# Altium schematic sheet Regulador.SchDoc
size A4; SheetNumber: 5; SheetTotal: 6
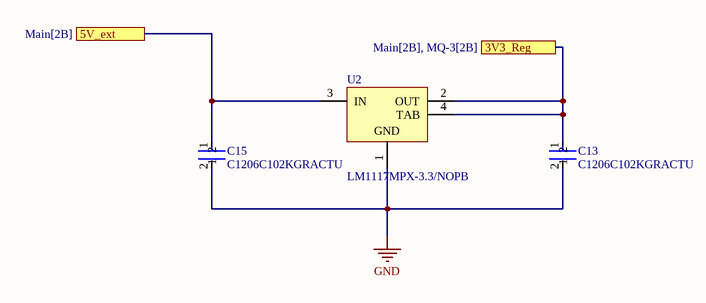
[diagram p0: Regulador.SchDoc]

## Parts
C13  C1206C102KGRACTU  [FP-C1206C-EF-IPC_A]
C15  C1206C102KGRACTU  [FP-C1206C-EF-IPC_A]
U2  LM1117MPX-3.3/NOPB  [DCY0004A_L]

## Ports
3V3_Reg (see Main[2B], MQ-3[2B]), 5V_ext (see Main[2B])

## Nets
GND: C13.2 C15.2 U2.1(GND)
3V3_Reg: C13.1 U2.2(OUT) U2.4(TAB) ; port 3V3_Reg
5V_ext: C15.1 U2.3(IN) ; port 5V_ext

## Library data of the parts
C13 C15 = CMP-03020-034681-1: CAP CER 1000PF 2KV X7R 1206; Tolerance: 10%; Capacitance: 1nF; Dissipation Factor: 2.5%; Dielectric Material: Ceramic; Voltage Rating (DC): 2.5kV; Voltage: 2kV; REACH SVHC: No SVHC; Height: 1.6mm; Construction: Flat; Case/Package: 1206; Series: C; Mount: Surface Mount; RoHS Compliant: Yes; Package Quantity: 1; Length: 3.2mm; Width: 0.063inch; Voltage Rating: 2kV; Min Operating Temperature: -55°C; Case Code (Metric): 3216; Termination: SMD/SMT; Number of Pins: 2; Case Code (Imperial): 1206; Packaging: Tape and Reel; Dielectric: X7R; Thickness: 0.069inch; Depth: 1.6mm; Radiation Hardening: No; Max Operating Temperature: 125°C
U2 = CMP-0062-01639-4: 800mA Low-Dropout Linear Regulator, 4-pin SOT-223, Pb-Free; Manufacturer: Texas Instruments; High-Reliability: Y; PowerWise: N; PackageTopMarking: XYTT*N05A; CompType: LDO IC; ComponentLink1URL: http://www.ti.com/general/docs/lit/getliterature.tsp?genericPartNumber=LM1117-N&fileType=pdf; PartNumber: LM1117MPX-3.3/NOPB; ComponentLink1Description: Datasheet URL; PinCount: 4; Code_JEDEC: TO-261-AA; PackageDescription: Molded SOT-223, 6.50 x 3.56 x 1.6mm Body, 4 Lead, 2.3mm Pitch; PackageReference: DCY0004A; RoHS: Y; Code_IPC: SOT223-4